# Altium schematic sheet Remote.SchDoc
size A; SheetNumber: 2; SheetTotal: 2
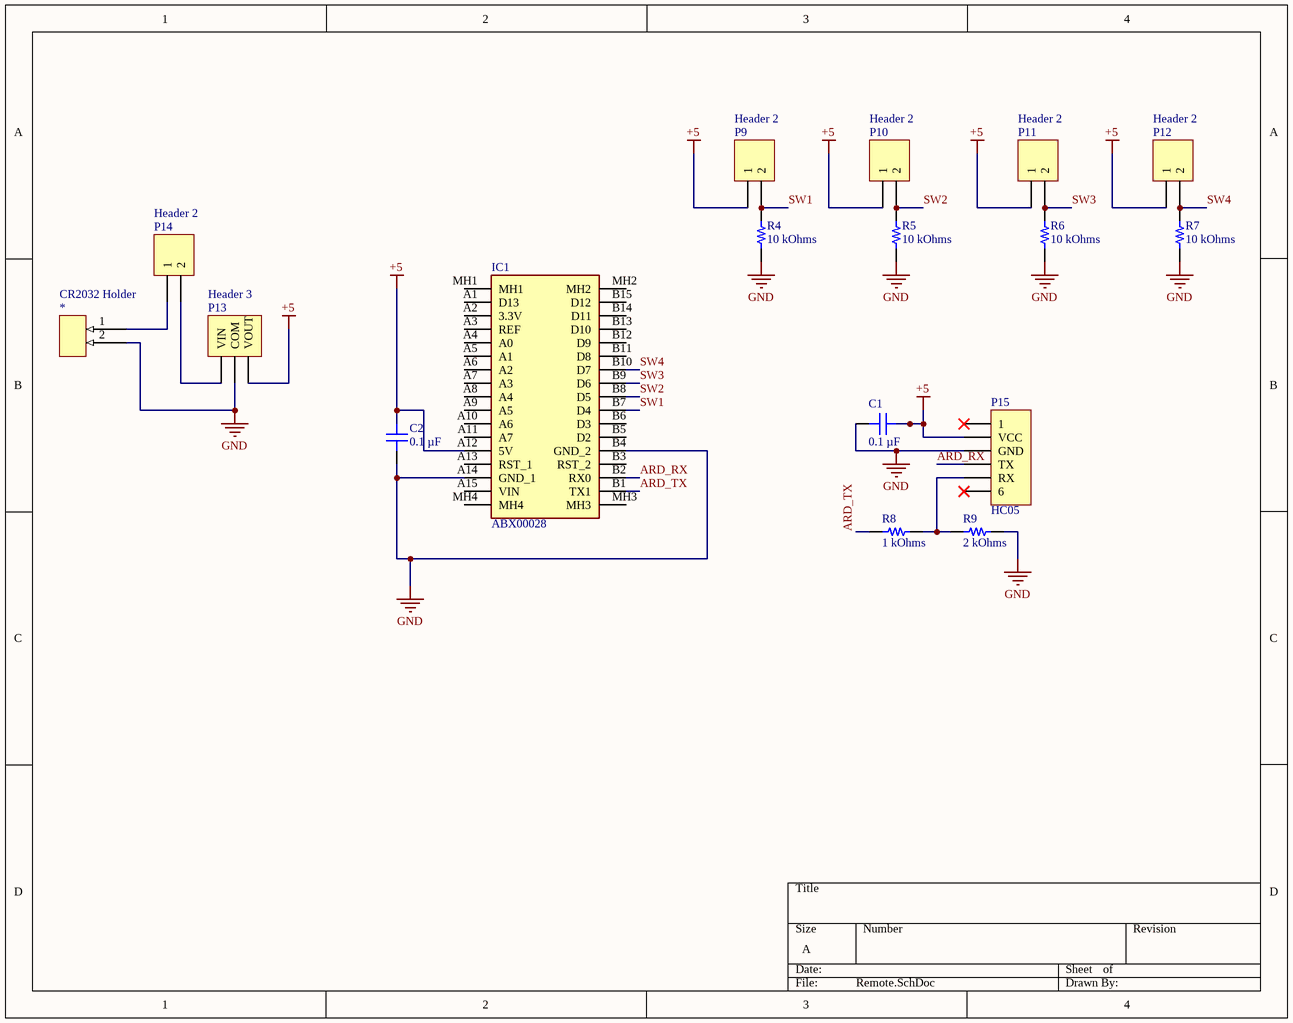
[diagram p0: Remote.SchDoc]

## Parts
*  CR2032 Holder  [CR2032 Holder-Footprint-1]
C1  0.1 µF  [CAP 1206_3216 - 0.8MM]
C2  0.1 µF  [CAP 1206_3216 - 0.8MM]
IC1  ABX00028  [ABX00028]
P9  Header 2  [HDR1X2]
P10  Header 2  [HDR1X2]
P11  Header 2  [HDR1X2]
P12  Header 2  [HDR1X2]
P13  Header 3  [HDR1X3]
P14  Header 2  [HDR1X2]
P15  HC05  [HDR1X6]
R4  10 kOhms  [RES 1206_3216]
R5  10 kOhms  [RES 1206_3216]
R6  10 kOhms  [RES 1206_3216]
R7  10 kOhms  [RES 1206_3216]
R8  1 kOhms  [RES 1206_3216]
R9  2 kOhms  [RES 1206_3216]

## Nets
+5: C1.2 C2.2 IC1.A12(5V) P9.1 P10.1 P11.1 P12.1 P13.3(VOUT) P15.2(VCC)
GND: *.2 C1.1 C2.1 IC1.A14(GND_1) IC1.B4(GND_2) P13.2(COM) P15.3(GND) R4.1 R5.1 R6.1 R7.1 R9.2
ARD_RX: IC1.B2(RX0) P15.4(TX)
ARD_TX: IC1.B1(TX1) R8.1
SW1: IC1.B7(D4) P9.2 R4.2
SW2: IC1.B8(D5) P10.2 R5.2
SW3: IC1.B9(D6) P11.2 R6.2
SW4: IC1.B10(D7) P12.2 R7.2
Net*_1: *.1 P14.1
NetP13_1: P13.1(VIN) P14.2
NetP15_5: P15.5(RX) R8.2 R9.1

Not connected (* = marked no-connect by the designer): IC1 A1(D13) A2(3.3V) A3(REF) A4(A0) A5(A1) A6(A2) A7(A3) A8(A4) A9(A5) A10(A6) A11(A7) A13(RST_1) A15(VIN) B3(RST_2) B5(D2) B6(D3) B11(D8) B12(D9) B13(D10) B14(D11) B15(D12) MH1 MH2 MH3 MH4; P15 1* 6*

## Library data of the parts
* = CMP-00005-2: Coin cell battery holder
C1 C2 = CC1206MRY5V9BB104: CAP CER 0.1UF 50V Y5V 1206; manufacturer: Yageo; Temperature Coefficient: Y5V (F); Tolerance: ±20%; Part Number: CC1206MRY5V9BB104; Value: 0.1 µF; Applications: General Purpose; Capacitance: 0.1 µF; componentlink1description: Datasheet; componentlink1url: http://www.yageo.com/documents/recent/UPY-GPHC_Y5V_6.3V-to-50V_8.pdf; componentlink2description: DigiKey Link; componentlink2url: https://www.digikey.com/en/products/detail/yageo/CC1206MRY5V9BB104/5884674; Device Package: 1206 (3216 Metric); lastupdated: 5/13/2023 7:18:07 PM; Lifecycle Status: Active; Minimum Order: 1; Mounting Type: Surface Mount, MLCC; Operating Temperature: -30°C ~ 85°C; Package / Case: 1206 (3216 Metric); packaging: TapeAndReel; partid: 18711; Part Status: Active; price: 0.04; series: CC; Size / Dimension: 0.126" L x 0.063" W (3.20mm x 1.60mm); Supplier 1: DigiKey; Supplier Part Number 1: 311-4504-1-ND; Thickness (Max): 0.028" (0.70mm); Voltage - Rated: 50V
IC1 = ABX00028: Integrated Circuit; Manufacturer_Name: Arduino; Datasheet Link: https://store.arduino.cc/arduino-nano-every; Height: 10mm; Manufacturer_Part_Number: ABX00028; Mouser Part Number: 782-ABX00028; Mouser Price/Stock: https://www.mouser.co.uk/ProductDetail/Arduino/ABX00028?qs=PzGy0jfpSMtit6rnFl8mVg%3D%3D; Arrow Part Number: ABX00028; Arrow Price/Stock: https://www.arrow.com/en/products/abx00028/arduino-corporation?region=nac
P9-P12 P14 = Header 2: Header, 2-Pin; LatestRevisionDate: 17-Jul-2002; LatestRevisionNote: Re-released for DXP Platform.; Publisher: Altium Limited
P13 = Header 3: Header, 3-Pin; LatestRevisionDate: 17-Jul-2002; LatestRevisionNote: Re-released for DXP Platform.; Publisher: Altium Limited
P15 = Header 6: Header, 6-Pin; LatestRevisionDate: 17-Jul-2002; LatestRevisionNote: Re-released for DXP Platform.; Publisher: Altium Limited
R4-R7 = CRG1206F10K: RES SMD 10K OHM 1% 1/4W 1206; Manufacturer: TE Connectivity Passive Product; Power (Watts): 0.25W, 1/4W; Temperature Coefficient: ±100ppm/°C; Part Number: CRG1206F10K; ComponentLink1Description: Datasheet; ComponentLink1URL: https://www.te.com/commerce/DocumentDelivery/DDEController?Action=srchrtrv&DocNm=1773204&DocType=DS&DocLang=English; ComponentLink2Description: DigiKey Link; ComponentLink2URL: https://www.digikey.com/en/products/detail/te-connectivity-passive-product/CRG1206F10K/2389909; Composition: Thick Film; Device Package: 1206 (3216 Metric); Height - Seated (Max): 0.026" (0.65mm); LastUpdated: 5/13/2023 7:46:04 PM; Lifecycle Status: Active; Minimum Order: 1; Number of Terminations: 2; Operating Temperature: -55°C ~ 155°C; Package / Case: 1206 (3216 Metric); Packaging: TapeAndReel; PartId: 26989; Part Status: Active; Price: 0.01; Resistance: 10 kOhms; Series: CRG, Neohm; Size / Dimension: 0.122" L x 0.061" W (3.10mm x 1.55mm); Supplier 1: DigiKey; Supplier Part Number 1: A106069CT-ND; Supplier Device Package: 1206; Tolerance: ±1%; Value: 10 kOhms
R8 = RNCS1206BKE1K00: RES 1K OHM 0.1% 1/8W 1206; Manufacturer: Stackpole Electronics Inc; Power (Watts): 0.125W, 1/8W; Temperature Coefficient: ±25ppm/°C; Part Number: RNCS1206BKE1K00; ComponentLink1Description: Datasheet; ComponentLink1URL: https://www.seielect.com/catalog/sei-rncs_rnch.pdf; ComponentLink2Description: DigiKey Link; ComponentLink2URL: https://www.digikey.com/en/products/detail/stackpole-electronics-inc/RNCS1206BKE1K00/1800333; Composition: Thin Film; Device Package: 1206 (3216 Metric); Features: Anti-Corrosive, Automotive AEC-Q200, Moisture Resistant; Height - Seated (Max): 0.026" (0.65mm); LastUpdated: 5/13/2023 7:46:05 PM; Lifecycle Status: Active; Minimum Order: 1; Number of Terminations: 2; Operating Temperature: -55°C ~ 155°C; Package / Case: 1206 (3216 Metric); Packaging: TapeAndReel; PartId: 26856; Part Status: Active; Price: 0.08; Ratings: AEC-Q200; Resistance: 1 kOhms; Series: RNCS; Size / Dimension: 0.120" L x 0.061" W (3.05mm x 1.55mm); Supplier 1: DigiKey; Supplier Part Number 1: RNCS1206BKE1K00CT-ND; Supplier Device Package: 1206; Tolerance: ±0.1%; Value: 1 kOhms
R9 = AC1206JR-072KL: RES SMD 2K OHM 5% 1/4W 1206; Manufacturer: Yageo; Power (Watts): 0.25W, 1/4W; Temperature Coefficient: ±100ppm/°C; Part Number: AC1206JR-072KL; ComponentLink1Description: Datasheet; ComponentLink1URL: https://www.yageo.com/upload/media/product/productsearch/datasheet/rchip/PYu-AC_51_RoHS_L_7.pdf; ComponentLink2Description: DigiKey Link; ComponentLink2URL: https://www.digikey.com/en/products/detail/yageo/AC1206JR-072KL/5897821; Composition: Thick Film; Device Package: 1206 (3216 Metric); Features: Automotive AEC-Q200, Moisture Resistant; Height - Seated (Max): 0.026" (0.65mm); LastUpdated: 5/13/2023 7:46:03 PM; Lifecycle Status: Active; Minimum Order: 1; Number of Terminations: 2; Operating Temperature: -55°C ~ 155°C; Package / Case: 1206 (3216 Metric); Packaging: TapeAndReel; PartId: 27112; Part Status: Active; Price: 0.01; Ratings: AEC-Q200; Resistance: 2 kOhms; Series: AC; Size / Dimension: 0.122" L x 0.063" W (3.10mm x 1.60mm); Supplier 1: DigiKey; Supplier Part Number 1: YAG3946CT-ND; Supplier Device Package: 1206; Tolerance: ±5%; Value: 2 kOhms